# EAGLE design totem_pole_vcf (EAGLE 9.6.2)
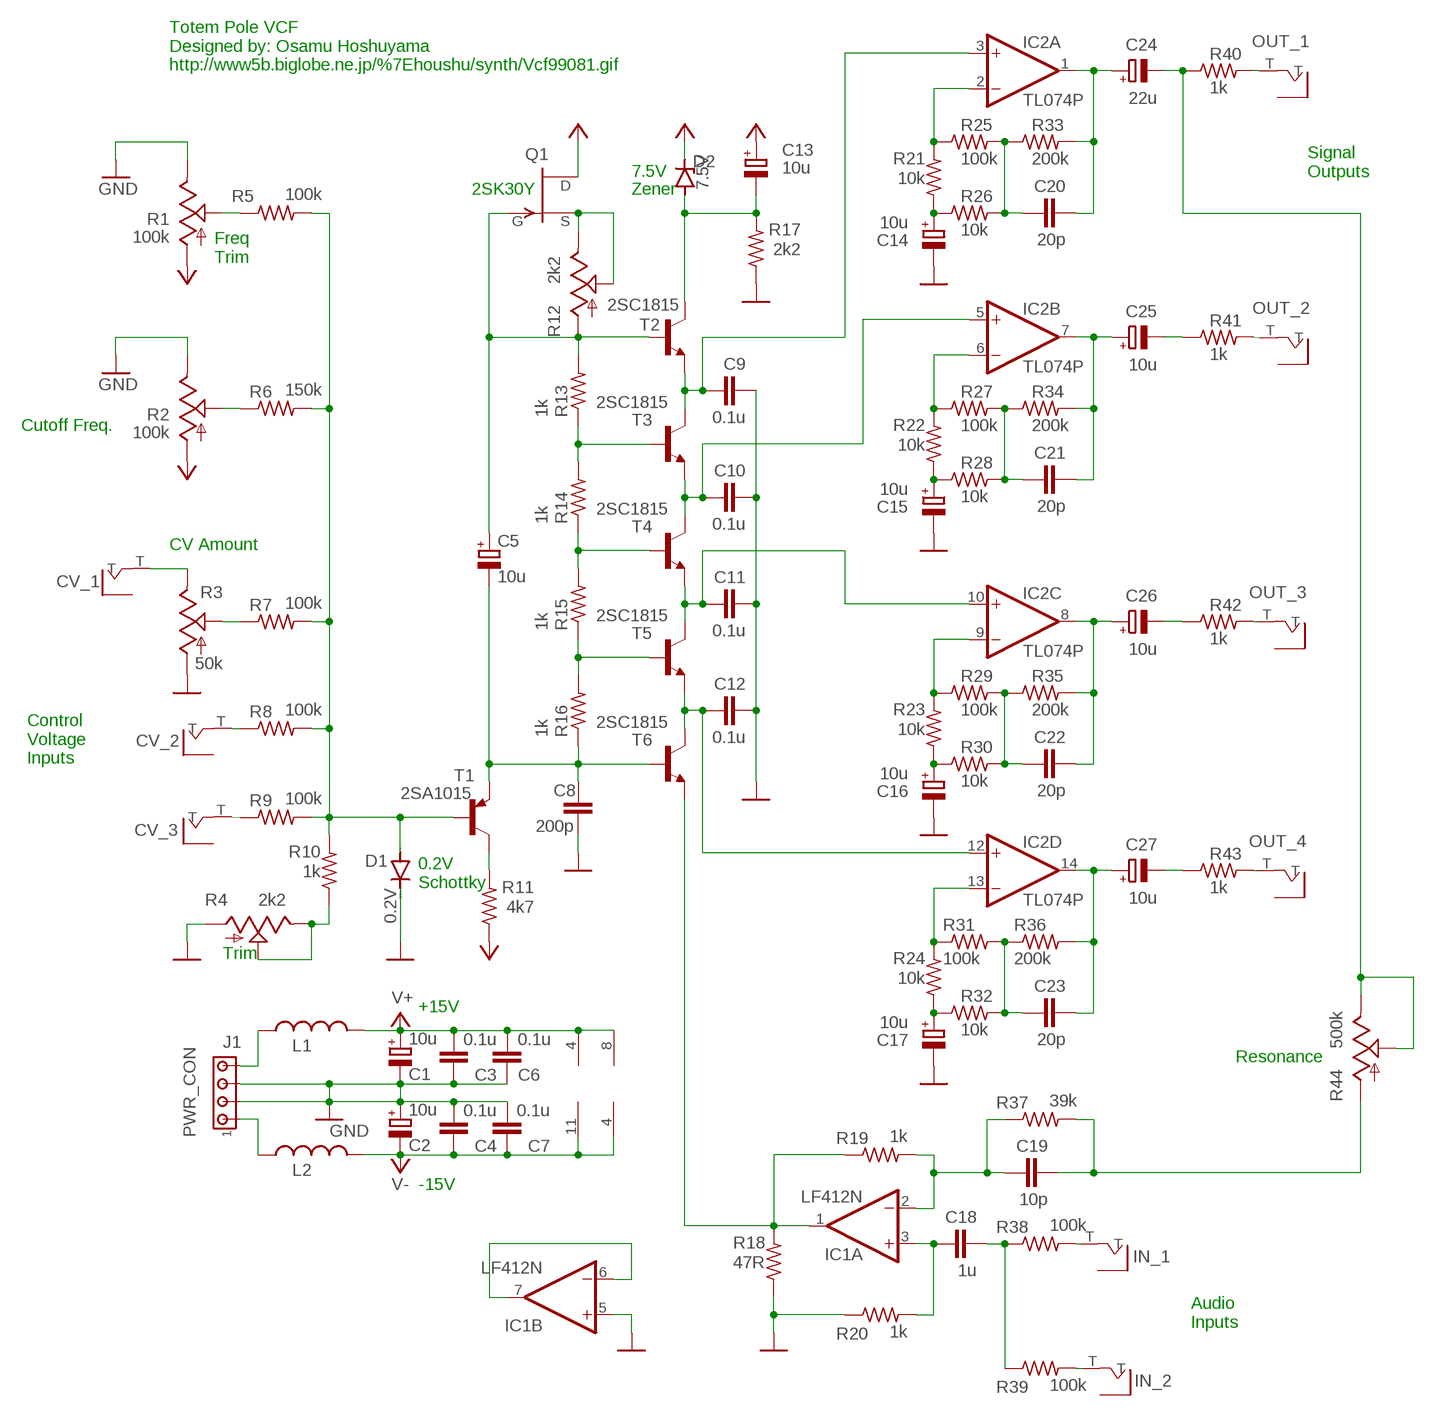
[diagram p0: schematic, sheet 1]

## Parts
C1  10u  CPOL-EUE1.8-4  [E1,8-4]
C2  10u  CPOL-EUE1.8-4  [E1,8-4]
C3  0.1u  C-EU050-025X075  [C050-025X075]
C4  0.1u  C-EU050-025X075  [C050-025X075]
C5  10u  CPOL-EUE1.8-4  [E1,8-4]
C6  0.1u  C-EU050-025X075  [C050-025X075]
C7  0.1u  C-EU050-025X075  [C050-025X075]
C8  200p  C-EU050-025X075  [C050-025X075]
C9  0.1u  C-EU050-025X075  [C050-025X075]
C10  0.1u  C-EU050-025X075  [C050-025X075]
C11  0.1u  C-EU050-025X075  [C050-025X075]
C12  0.1u  C-EU050-025X075  [C050-025X075]
C13  10u  CPOL-EUE1.8-4  [E1,8-4]
C14  10u  CPOL-EUE1.8-4  [E1,8-4]
C15  10u  CPOL-EUE1.8-4  [E1,8-4]
C16  10u  CPOL-EUE1.8-4  [E1,8-4]
C17  10u  CPOL-EUE1.8-4  [E1,8-4]
C18  1u  C-EU050-025X075  [C050-025X075]
C19  10p  C-EU050-025X075  [C050-025X075]
C20  20p  C-EU050-025X075  [C050-025X075]
C21  20p  C-EU050-025X075  [C050-025X075]
C22  20p  C-EU050-025X075  [C050-025X075]
C23  20p  C-EU050-025X075  [C050-025X075]
C24  22u  CPOL-EUE1.8-4  [E1,8-4]
C25  10u  CPOL-EUE1.8-4  [E1,8-4]
C26  10u  CPOL-EUE1.8-4  [E1,8-4]
C27  10u  CPOL-EUE1.8-4  [E1,8-4]
CV_1  OFFBOARD_JACK  [OFFBOARD_JACK]
CV_2  OFFBOARD_JACK  [OFFBOARD_JACK]
CV_3  OFFBOARD_JACK  [OFFBOARD_JACK]
D1  0.2V  DIODE-D-10  [D-10]
D2  7.5V  ZENER-DIODEDO41Z10  [DO41Z10]
IC1  LF412N  [DIL08]
IC2  TL074P  [DIL14]
IN_1  OFFBOARD_JACK  [OFFBOARD_JACK]
IN_2  OFFBOARD_JACK  [OFFBOARD_JACK]
J1  PWR_CON  MTA04-156  [1X4MTA]
L1  BEAD  L-US0207/10  [0207/10]
L2  BEAD  L-US0207/10  [0207/10]
OUT_1  OFFBOARD_JACK  [OFFBOARD_JACK]
OUT_2  OFFBOARD_JACK  [OFFBOARD_JACK]
OUT_3  OFFBOARD_JACK  [OFFBOARD_JACK]
OUT_4  OFFBOARD_JACK  [OFFBOARD_JACK]
Q1  2N3819  [TO92]
R1  100k  TRIM_US-RS3  [RS3]
R2  100k  TRIM_US-B64Y  [B64Y]
R3  50k  TRIM_US-B64Y  [B64Y]
R4  2k2  TRIM_US-RS3  [RS3]
R5  100k  R-US_0207/10  [0207/10]
R6  150k  R-US_0207/10  [0207/10]
R7  100k  R-US_0207/10  [0207/10]
R8  100k  R-US_0207/10  [0207/10]
R9  100k  R-US_0207/10  [0207/10]
R10  1k  R-US_0207/10  [0207/10]
R11  4k7  R-US_0207/10  [0207/10]
R12  2k2  TRIM_US-RS3  [RS3]
R13  1k  R-US_0207/10  [0207/10]
R14  1k  R-US_0207/10  [0207/10]
R15  1k  R-US_0207/10  [0207/10]
R16  1k  R-US_0207/10  [0207/10]
R17  2k2  R-US_0207/10  [0207/10]
R18  47R  R-US_0207/10  [0207/10]
R19  1k  R-US_0207/10  [0207/10]
R20  1k  R-US_0207/10  [0207/10]
R21  10k  R-US_0207/10  [0207/10]
R22  10k  R-US_0207/10  [0207/10]
R23  10k  R-US_0207/10  [0207/10]
R24  10k  R-US_0207/10  [0207/10]
R25  100k  R-US_0207/10  [0207/10]
R26  10k  R-US_0207/10  [0207/10]
R27  100k  R-US_0207/10  [0207/10]
R28  10k  R-US_0207/10  [0207/10]
R29  100k  R-US_0207/10  [0207/10]
R30  10k  R-US_0207/10  [0207/10]
R31  100k  R-US_0207/10  [0207/10]
R32  10k  R-US_0207/10  [0207/10]
R33  200k  R-US_0207/10  [0207/10]
R34  200k  R-US_0207/10  [0207/10]
R35  200k  R-US_0207/10  [0207/10]
R36  200k  R-US_0207/10  [0207/10]
R37  39k  R-US_0207/10  [0207/10]
R38  100k  R-US_0207/10  [0207/10]
R39  100k  R-US_0207/10  [0207/10]
R40  1k  R-US_0207/10  [0207/10]
R41  1k  R-US_0207/10  [0207/10]
R42  1k  R-US_0207/10  [0207/10]
R43  1k  R-US_0207/10  [0207/10]
R44  500k  TRIM_US-RS3  [RS3]
T1  2SA1015  -PNP-TO92  [TO92]
T2  2SC1815  [TO92-ECB]
T3  2SC1815  [TO92-ECB]
T4  2SC1815  [TO92-ECB]
T5  2SC1815  [TO92-ECB]
T6  2SC1815  [TO92-ECB]

## Nets
GND: C1.- C2.+ C3.2 C4.1 C6.1 C7.1 C8.1 C9.2 C10.2 C11.2 C12.2 C14.- C15.- C16.- C17.- D1.C IC1.5(B:+IN) J1.2 J1.3 R1.E R2.E R3.A R4.A R17.1 R18.1 R20.1
N$1: D1.A R5.2 R6.2 R7.2 R8.2 R9.2 R10.2 T1.2(B)
N$2: C5.- C8.2 R16.1 T1.1(E) T6.B
N$3: C12.1 IC2.12(D:+IN) T5.E T6.C
N$4: R15.1 R16.2 T5.B
N$5: R14.1 R15.2 T4.B
N$6: R13.1 R14.2 T3.B
N$7: OUT_1.T R40.2
N$8: C11.1 IC2.10(C:+IN) T4.E T5.C
N$9: C9.1 IC2.3(A:+IN) T2.E T3.C
N$10: C5.+ Q1.2(G) R12.A R13.2 T2.B
N$11: IC2.2(A:-IN) R21.2 R25.1
N$12: Q1.3(S) R12.E R12.S
N$13: C14.+ R21.1 R26.1
N$14: C20.1 R25.2 R26.2 R33.1
N$15: C20.2 C24.+ IC2.1(A:OUT) R33.2
N$16: C13.- D2.A R17.2 T2.C
N$17: C18.1 IC1.3(A:+IN) R20.2
N$18: C18.2 R38.1 R39.1
N$19: IC1.1(A:OUT) R18.2 R19.1 T6.E
N$20: IC2.6(B:-IN) R22.2 R27.1
N$21: C19.1 IC1.2(A:-IN) R19.2 R37.1
N$22: C19.2 R37.2 R44.A
N$23: C15.+ R22.1 R28.1
N$24: C21.1 R27.2 R28.2 R34.1
N$25: C21.2 C25.+ IC2.7(B:OUT) R34.2
N$26: C25.- R41.1
N$27: IC2.9(C:-IN) R23.2 R29.1
N$28: C16.+ R23.1 R30.1
N$29: C22.1 R29.2 R30.2 R35.1
N$30: C22.2 C26.+ IC2.8(C:OUT) R35.2
N$31: C26.- R42.1
N$32: IC2.13(D:-IN) R24.2 R31.1
N$33: C17.+ R24.1 R32.1
N$34: C23.1 R31.2 R32.2 R36.1
N$35: C23.2 C27.+ IC2.14(D:OUT) R36.2
N$36: C27.- R43.1
N$37: IC1.6(B:-IN) IC1.7(B:OUT)
N$38: R3.S R7.1
N$39: R4.E R4.S R10.1
N$40: J1.1 L2.1
N$41: J1.4 L1.1
N$42: C10.1 IC2.5(B:+IN) T3.E T4.C
N$43: R2.S R6.1
N$44: R1.S R5.1
N$45: R11.2 T1.3(C)
N$46: CV_1.T R3.E
N$47: OUT_2.T R41.2
N$48: CV_2.T R8.1
N$49: CV_3.T R9.1
N$50: OUT_3.T R42.2
N$51: OUT_4.T R43.2
N$52: IN_1.T R38.2
N$53: IN_2.T R39.2
N$55: C24.- R40.1 R44.E R44.S
V+: C1.+ C3.1 C6.2 C13.+ D2.C IC1.8(P:V+) IC2.4(P:V+) L1.2 Q1.1(D)
V-: C2.- C4.2 C7.2 IC1.4(P:V-) IC2.11(P:V-) L2.2 R1.A R2.A R11.1

## Notes on the sheet
- Totem Pole VCF
  Designed by: Osamu Hoshuyama
  http://www5b.biglobe.ne.jp/%7Ehoushu/synth/Vcf99081.gif
- 7.5V
- Signal
  Outputs
- 2SK30Y | Zener
- Freq
  Trim
- Cutoff Freq.
- CV Amount
- Control
  Voltage
  Inputs
- 0.2V
  Schottky
- Trim
- +15V
- Resonance
- -15V
- Audio
  Inputs

## Library data of the parts
C1 C2 C5 C13-C17 C24-C27 = rcl:CPOL-EU: POLARIZED CAPACITOR, European symbol; SPICEPREFIX: C
C3 C4 C6-C12 C18-C23 = rcl:C-EU: CAPACITOR, European symbol; SPICEPREFIX: C
CV_1-CV_3 IN_1 IN_2 OUT_1-OUT_4 = OFFBOARD_JACK:OFFBOARD_JACK
D1 = diode:DIODE-: DIODE
D2 = diode:ZENER-DIODE: Z-Diode
IC1 = linear:LF412: OP AMP
IC2 = linear:TL074: OP AMP
J1 = con-amp:MTA04-156: AMP connector
L1 L2 = rcl:L-US: INDUCTOR, American symbol; SPICEPREFIX: L
Q1 = transistor-fet:2N3819: N-Channel Junction FET
R1-R4 R12 R44 = pot:TRIM_US-: POTENTIOMETER
R5-R11 R13-R43 = rcl:R-US_: RESISTOR, American symbol; SPICEPREFIX: R
T1 = transistor:*-PNP-: PNP Transistror
T2-T6 = transistor:2SC1815: NPN EPITAXIAL TRANSISTOR Source: TOSHIBA .. 2SC1815 1.pdf

## Board
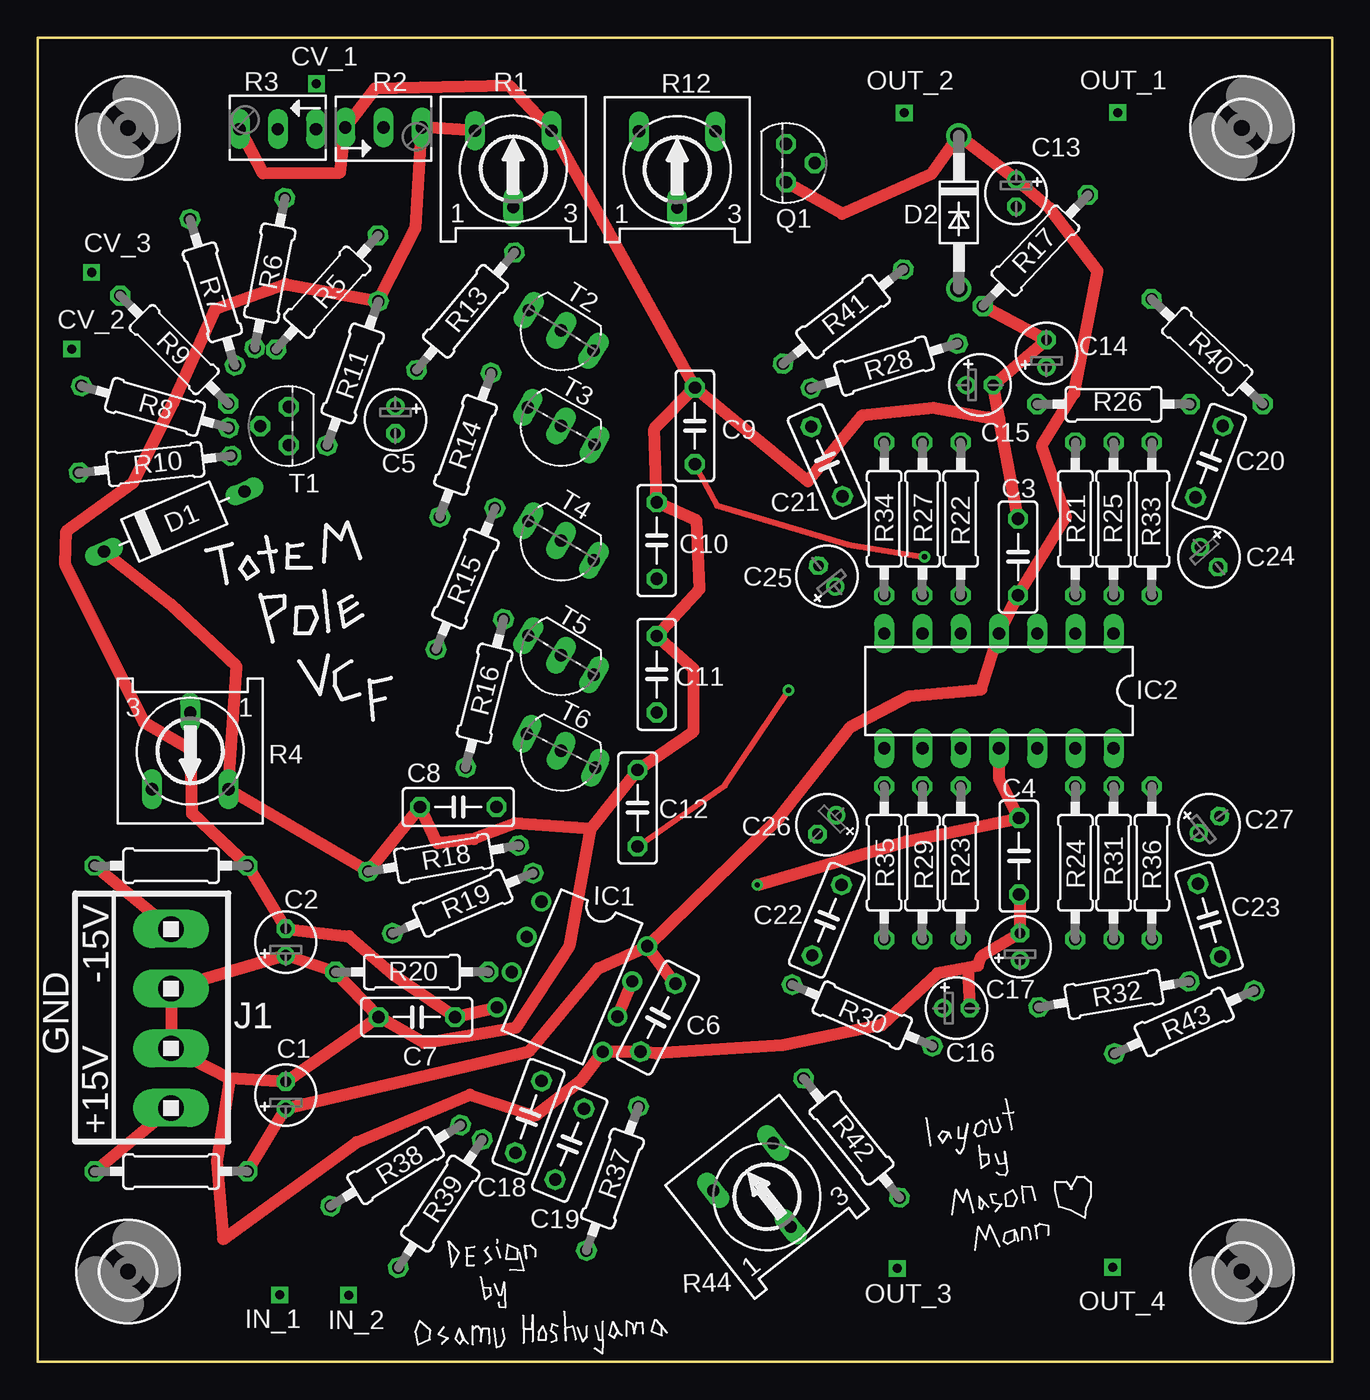
[diagram p1: board, top side]
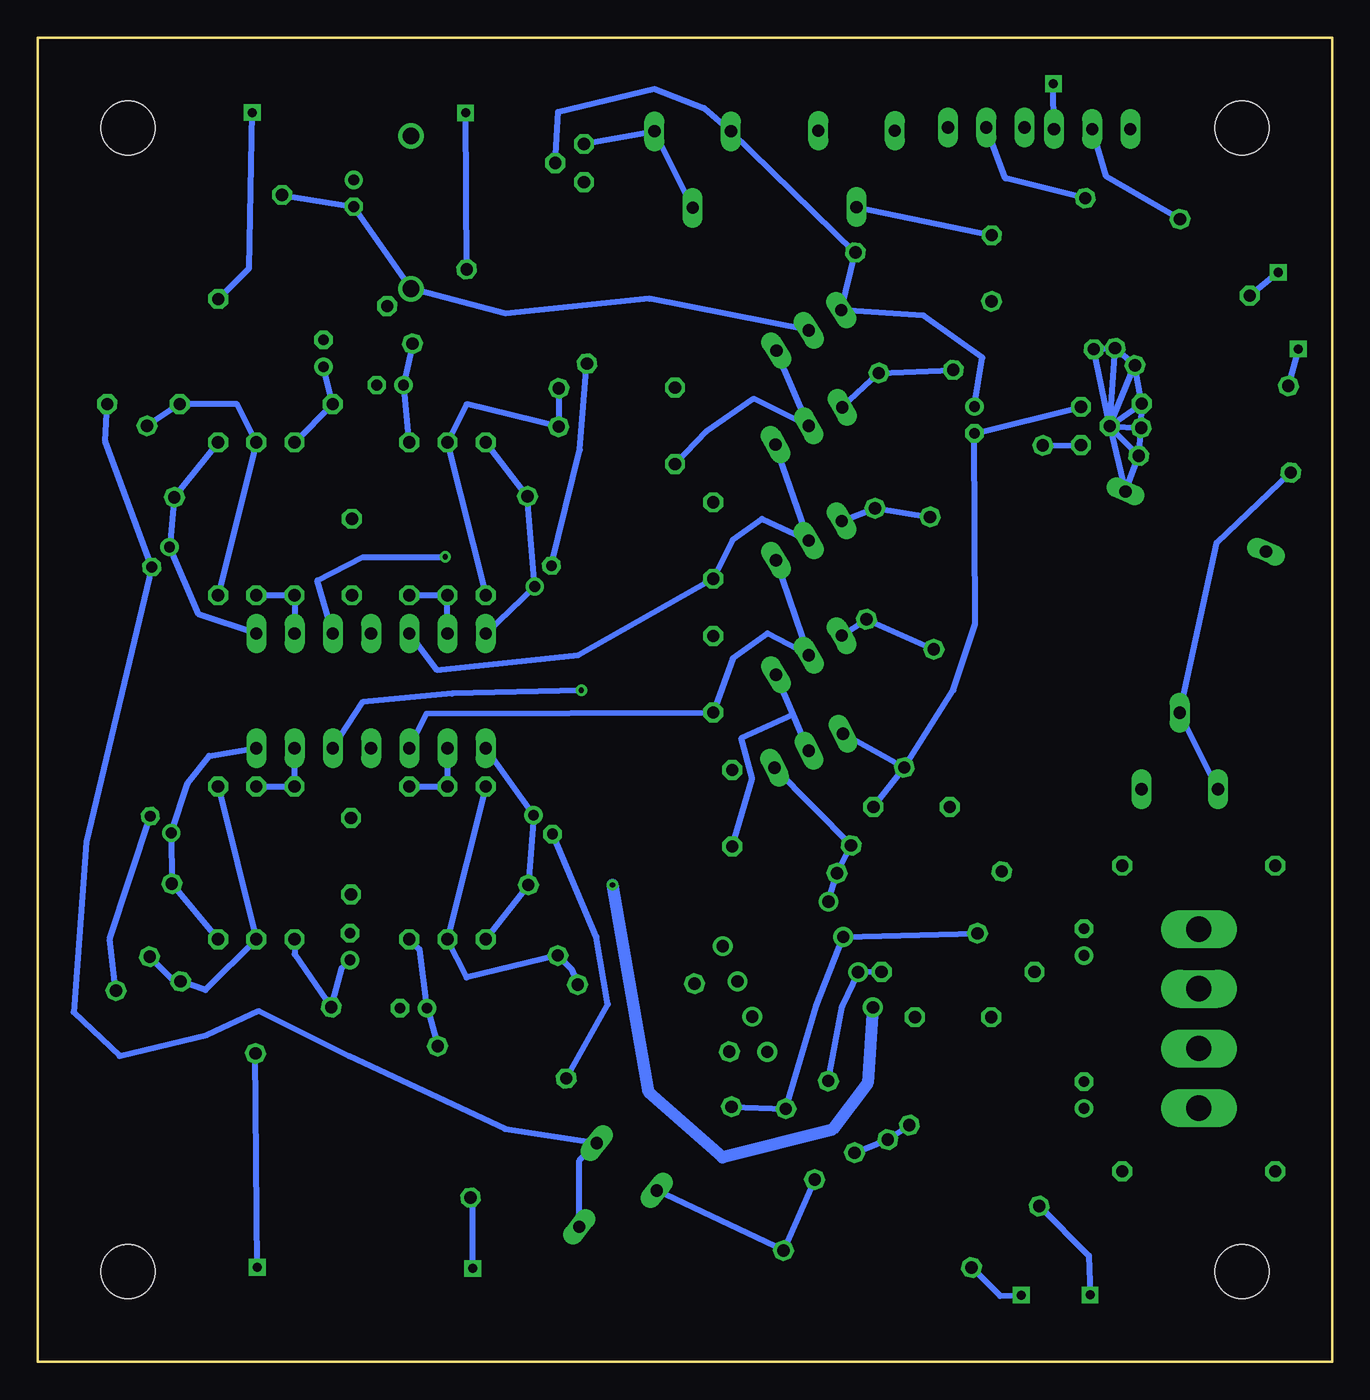
[diagram p2: board, bottom side, seen from below]

Size 86.01 x 88.01 mm. Coordinates in mm from the lower left corner, seen from the top.
Outline: 0,0 86,0 86.01,88.01 0,88 0,0
Copper layers (1*16): Top 0.035mm / dielectric 1.5mm / Bottom 0.035mm
Design rules "default": minimum track width 6mil, minimum drill 0.35mm, track to track 6mil, track to pad 6mil, pad to pad 6mil, via to via 6mil, smd to smd 6mil, copper to edge 40mil, drill to drill 6mil, minimum pad ring 10mil, minimum via ring 8mil, stop-mask expansion 4mil, vias tented up to drill 0mil, thermal gap 10mil
Milling: 4 lines

### Footprints (pad centres in the part's own frame; a part is rotated, then mirrored left to right if it is on the bottom)
E1,8-4 = drill 0.711 pad 1.168: + -0.889,0 | drill 0.711 pad 1.168 octagon: - 0.889,0
C050-025X075 = drill 0.813 octagon: 1 -2.54,0; 2 2.54,0
OFFBOARD_JACK = drill 0.6 square: T 0,0
D-10 = drill 0.813 long: A 5.08,0; C -5.08,0
DO41Z10 = drill 1.118: A 5.08,0; C -5.08,0
DIL08 = drill 0.813 pad 1.27: 1 -3.81,-3.81; 2 -1.27,-3.81; 3 1.27,-3.81; 4 3.81,-3.81; 5 3.81,3.81; 6 1.27,3.81; 7 -1.27,3.81; 8 -3.81,3.81
DIL14 = drill 0.813 long: 1 -7.62,-3.81; 2 -5.08,-3.81; 3 -2.54,-3.81; 4 0,-3.81; 5 2.54,-3.81; 6 5.08,-3.81; 7 7.62,-3.81; 8 7.62,3.81; 9 5.08,3.81; 10 2.54,3.81; 11 0,3.81; 12 -2.54,3.81; 13 -5.08,3.81; 14 -7.62,3.81
1X4MTA = drill 1.676 long: 1 5.944,0; 2 1.981,0; 3 -1.981,0; 4 -5.944,0
0207/10 = drill 0.813 octagon: 1 -5.08,0; 2 5.08,0
TO92 = drill 0.813 octagon: 1 1.27,0; 2 0,1.905; 3 -1.27,0
RS3 = drill 0.813 long: A -2.54,2.54; E 2.54,2.54; S 0,-2.54
B64Y = drill 0.813 long: A 2.54,0; E -2.54,0; S 0,0
TO92-ECB = drill 0.813 long: B 2.54,0; C 0,0; E -2.54,0
3,6 = hole 3.6: 0,0

### Placement (x,y rotation side)
C1  16.48,17.74 90 top
C2  16.48,27.9 90 top
C3  65.13,53.49 90 top
C4  65.19,33.61 90 top
C5  23.77,62.59 270 top
C6  41.21,22.87 62.9 top
C7  25.19,22.91 0 top
C8  27.95,36.87 0 top
C9  43.66,62.2 90 top
C10  41.12,54.58 90 top
C11  41.12,45.69 90 top
C12  39.85,36.8 90 top
C13  65.01,77.66 270 top
C14  67.02,67.02 90 top
C15  62.59,64.92 0 top
C16  61.04,23.51 0 top
C17  65.26,27.6 90 top
C18  32.61,16.28 250 top
C19  35.34,14.47 247.8 top
C20  77.83,59.84 249.1 top
C21  52.43,59.84 294.1 top
C22  52.43,29.36 67.4 top
C23  77.83,29.36 106.9 top
C24  77.83,53.49 311.7 top
C25  52.43,52.22 128.7 top
C26  52.43,35.71 225 top
C27  77.83,35.71 38.7 top
CV_1  18.52,84.95 0 top
CV_2  2.26,67.31 0 top
CV_3  3.59,72.4 0 top
D1  9.07,55.84 23.2 top
D2  61.2,76.39 270 top
IC1  35.51,25.59 247.2 top
IC2  63.86,44.6 180 top
IN_1  16.09,4.45 0 top
IN_2  20.66,4.43 0 top
J1  8.86,22.82 90 top
L1  8.86,12.66 0 top
L2  8.86,32.98 0 top
OUT_1  71.75,83.03 0 top
OUT_2  57.58,83.01 0 top
OUT_3  57.11,6.21 0 top
OUT_4  71.41,6.29 0 top
Q1  49.71,79.67 270 top
R1  31.6,79.28 0 top
R2  22.98,82.04 0 top
R3  15.95,81.92 180 top
R4  10.13,40.6 180 top
R5  19.23,71.08 228.2 top
R6  15.42,72.35 258.7 top
R7  11.61,71.08 287.1 top
R8  7.8,63.46 344.1 top
R9  9.07,67.27 315 top
R10  7.8,59.65 6.3 top
R11  20.93,65.69 250.4 top
R12  42.49,79.24 0 top
R13  28.42,69.82 50.2 top
R14  28.42,60.93 70.4 top
R15  28.42,52.04 67.4 top
R16  29.69,44.42 75.7 top
R17  66.28,73.85 46.6 top
R18  26.96,33.45 9.8 top
R19  28.24,30.48 203.2 top
R20  24.86,25.91 0 top
R21  68.94,56.03 270 top
R22  61.32,56.03 270 top
R23  61.32,33.17 90 top
R24  68.94,33.17 90 top
R25  71.48,56.03 90 top
R26  71.48,63.65 0 top
R27  58.78,56.03 90 top
R28  56.24,66.19 197 top
R29  58.78,33.17 270 top
R30  54.78,23.03 156.3 top
R31  71.48,33.17 270 top
R32  71.51,24.43 9.7 top
R33  74.02,56.03 90 top
R34  56.24,56.03 90 top
R35  56.24,33.17 270 top
R36  74.02,33.17 270 top
R37  38.18,12.18 250.1 top
R38  23.79,13.04 211.9 top
R39  26.75,10.52 236.8 top
R40  77.7,67.14 136.6 top
R41  53.51,69.47 38.1 top
R42  54.07,14.88 308.8 top
R43  76.17,22.58 204.2 top
R44  48.45,10.97 38.3 top
T1  16.69,62.19 90 top
T2  34.77,68.55 148 top
T3  34.77,62.2 150.9 top
T4  34.77,54.58 149.1 top
T5  34.77,46.96 149.1 top
T6  34.77,40.61 153.5 top
U$1  [3,6]  6,82 0 top
U$2  [3,6]  6,6 0 top
U$3  [3,6]  80,6 0 top
U$4  [3,6]  80,82 0 top

### Tracks (layer width: path | path; a pad name or v marks a point on that pad's centre or on a via)
GND
  Top 0.813: C3.2 63.89,62.68 | 63.89,62.68 C15.- C14.- R17.1 | C4.1 65.26,31.01 C17.- 62.7,26.94 62.45,26.32 61.8,26.2 | 61.8,26.2 C16.- | C7.1 C1.- 12.75,18.84 | C7.1 R20.1 C2.+ J1.2 J1.3 12.75,18.84 | C7.1 25.67,21.19 31.79,22.21 35.34,27.65 36.73,35.43 | 36.73,35.43 C12.2 43.58,41.91 43.58,46.05 C11.2 43.99,51.36 43.78,55.9 C10.2 40.98,62.02 C9.2 | 36.73,35.43 31.71,35.8 28.98,34.75 26.56,34.46 C8.1 R18.1 R4.A 13.21,46.21 8.85,50.34 D1.C | R3.A 14.96,78.99 20.09,79.03 R2.E 22.4,84.62 31.36,84.81 R1.E 37.53,75.76 C9.2 | C9.2 48.76,60.53 51.17,58.52 54.79,62.9 59.5,63.42 63.15,62.76 63.89,62.68 | 61.8,26.2 59.78,25.82 56.11,22.39 49.49,21.04 41.1,20.49 C6.1 IC1.5 36.18,18.78 33.02,16.35 28.71,17.75 21.18,14.59 12.32,8.16 11.9,13.32 12.75,18.84
N$1
  Bottom 0.406: R10.2 D1.A T1.2 | R10.2 R8.2 | R8.2 R9.2 | R9.2 R7.2 | T1.2 R8.2 | R7.2 R6.2 | R6.2 R5.2 T1.2 | T1.2 R9.2 | T1.2 R7.2 | T1.2 R6.2 | T1.2 R10.2
N$2
  Bottom 0.406: T6.B R16.1 | C8.2 R16.1 | T1.1 C5.- 23.72,49.04 25.17,44.64 R16.1
N$3  (via drill 0.35)
  Top 0.406: C12.1 45.66,38.3 v49.89,44.63
  Bottom 0.406: T6.C 35.82,43.03 | 35.82,43.03 T5.E | C12.1 38.54,38.76 39.25,41.45 35.82,43.03 | IC2.12 64.41,43.84 58.49,44.41 v49.89,44.63
N$4
  Bottom 0.406: T5.B R16.2 R15.1
N$5
  Bottom 0.406: T4.B R15.2 R14.1
N$6
  Bottom 0.406: T3.B R14.2 R13.1
N$7
  Bottom 0.406: R40.2 71.96,72.67 OUT_1.T
N$8
  Bottom 0.406: T4.E T5.C 37.52,48.41 39.83,46.73 C11.1 60.17,43.09 IC2.10
N$9  (via drill 0.35)
  Top 0.406: C9.1 45.14,56.9 53.87,54.3 v58.93,53.5
  Bottom 0.406: T2.E T3.C 38.42,64 41.59,61.81 C9.1 | IC2.3 67.42,51.94 64.39,53.48 v58.93,53.5
N$10
  Bottom 0.406: C5.+ 23.24,66.74 27.17,69.54 T2.B R13.2 R12.A 41.73,83.32 45.04,84.59 51.43,83.08 Q1.2
N$11
  Bottom 0.406: R25.1 R21.2 IC2.2
N$12
  Bottom 0.406: R12.S R12.E Q1.3
N$13
  Bottom 0.406: R21.1 R26.1 C14.+
N$14
  Bottom 0.406: R33.1 R25.2 72.75,63.65 R26.2 C20.1
N$15
  Bottom 0.406: R33.2 C20.2 C24.+ 75.29,49.68 IC2.1
N$16
  Bottom 0.406: T2.C 45.36,70.65 54.91,69.68 D2.A C13.- R17.2
N$17
  Bottom 0.406: C18.1 32.55,23.65 IC1.3 R20.2
N$18
  Bottom 0.406: C18.2 R39.1 R38.1
N$19
  Bottom 0.406: IC1.1 R19.1 R18.2 T6.E
N$20
  Bottom 0.406: R22.2 R27.1 IC2.6
N$21
  Bottom 0.406: R37.1 C19.1 34.27,23.67 IC1.2 R19.2
N$22
  Bottom 0.406: R44.A R37.2 C19.2
N$23
  Bottom 0.406: R28.1 61.68,65 | 61.68,65 C15.+ | R22.1 61.68,65
N$24
  Bottom 0.406: R34.1 R27.2 57.51,63.65 C21.1 R28.2
N$25
  Bottom 0.406: R34.2 C21.2 C25.+ IC2.7
N$26
  Bottom 0.406: C25.- 49.99,60.63 R41.1
N$27
  Bottom 0.406: IC2.9 R29.1 R23.2
N$28
  Bottom 0.406: R30.1 60.09,23.45 C16.+ 60.65,27.42 R23.1
N$29
  Bottom 0.406: R35.1 R29.2 57.51,25.55 C22.1 50.54,26.1 R30.2
N$30
  Bottom 0.406: R35.2 53.42,31.68 | 53.42,31.68 C22.2 | 53.42,31.68 C26.+ IC2.8
N$31
  Bottom 0.406: C26.- 48.88,28.24 48.12,23.76 R42.1
N$32
  Bottom 0.406: R31.1 R24.2 IC2.13
N$33
  Bottom 0.406: R24.1 68.94,27.08 R32.1 65.8,26.16 C17.+
N$34
  Bottom 0.406: C23.1 76.53,24.89 R32.2 74.86,24.71 R31.2 R36.1
N$35
  Bottom 0.406: R36.2 C23.2 C27.+ 76.02,38.46 74.62,40.28 IC2.14
N$36
  Bottom 0.406: R43.1 81.21,28.12 C27.-
N$37
  Top 0.813: IC1.6 IC1.7
N$38
  Bottom 0.406: R7.1 15,78.77 R3.S
N$39
  Bottom 0.406: R4.E R4.S 7.69,54.42 R10.1
N$40
  Top 0.813: J1.1 L2.1
N$41
  Top 0.813: L1.1 J1.4
N$42
  Bottom 0.406: T3.E T4.C 37.87,56.01 39.83,54.6 C10.1 50.11,46.97 59.48,45.98 IC2.5
N$43
  Bottom 0.406: R6.1 21.72,78.65 R2.S
N$44
  Bottom 0.406: R1.S R5.1
N$45
  Bottom 0.406: R11.2 T1.3
N$46
  Bottom 0.406: R3.E CV_1.T
N$47
  Bottom 0.406: R41.2 OUT_2.T
N$48
  Bottom 0.406: CV_2.T R8.1
N$49
  Bottom 0.406: R9.1 CV_3.T
N$50
  Bottom 0.406: R42.2 57.11,10.91 OUT_3.T
N$51
  Bottom 0.406: OUT_4.T R43.2
N$52
  Bottom 0.406: IN_1.T 16.18,7.06 R38.2
N$53
  Bottom 0.406: R39.2 22.07,4.38 IN_2.T
N$55
  Bottom 0.406: R44.S 50.02,13.39 R44.E 54.94,15.48 65.33,20.32 71.31,23.31 74.73,21.75 80.56,20.32 83.62,23.24 82.77,34.56 C24.- 81.5,61.19 R40.1
V+
  Top 0.813: C6.2 IC1.8 | L1.2 C1.+ 32.66,20.64 37.26,26.16 IC1.8 | Q1.1 53.45,76.29 59.39,78.95 D2.C C13.+ 67.25,76.67 70.42,72.49 68.87,64.37 66.71,60.89 68.33,56.17 C3.1 IC2.4 62.69,44.7 57.9,44.25 53.99,42.19 49.24,36.13 IC1.8
V-  (via drill 0.35)
  Top 0.813: IC2.11 63.86,38.82 C4.2 65.14,36.1 57.71,34.6 v47.81,31.7 | IC1.4 C7.2 23.59,25.76 20.68,28.28 C2.- L2.2 10.26,36.43 10.17,40.69 7.07,42.48 1.83,53.04 1.92,55.21 6.35,58.43 9.02,63.72 11.83,69.98 16.45,71.62 R11.1 25.11,75.37 R2.A R1.A
  Bottom 0.813: IC1.4 30.88,18.53 33.22,15.42 40.5,13.59 45.39,17.92 v47.81,31.7

### Text on the board
tPlace: -15V | GND | +15V